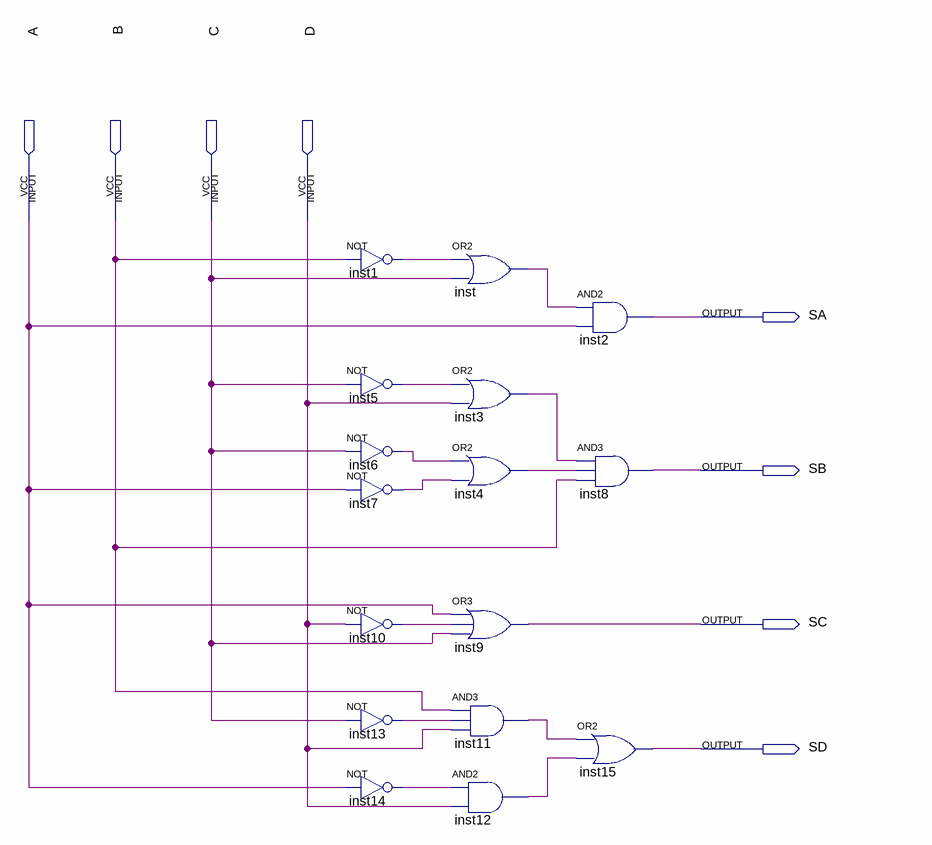
[diagram p0: schematic sheet]
// Quartus schematic trabalho.bdf as structural Verilog: 16 symbols, 8 pins
module trabalho (
  input  A,
  input  B,
  input  C,
  input  D,
  output SA,
  output SB,
  output SC,
  output SD
);

  wire inst1_out, inst3_out, inst4_out, inst5_out, inst6_out, inst7_out, inst10_out, inst11_out, inst12_out,
       inst13_out, inst14_out, inst_out;

  not inst1 (inst1_out, B);
  not inst5 (inst5_out, C);
  not inst6 (inst6_out, C);
  not inst7 (inst7_out, A);
  not inst10 (inst10_out, D);
  not inst13 (inst13_out, C);
  not inst14 (inst14_out, A);
  or inst (inst_out, inst1_out, C);
  or inst3 (inst3_out, inst5_out, D);
  or inst4 (inst4_out, inst6_out, inst7_out);
  or inst9 (SC, A, inst10_out, C);
  and inst11 (inst11_out, B, inst13_out, D);
  and inst12 (inst12_out, inst14_out, D);
  and inst2 (SA, inst_out, A);
  and inst8 (SB, inst3_out, inst4_out, B);
  or inst15 (SD, inst11_out, inst12_out);
endmodule
